# EAGLE design HydroPCB (EAGLE 9.3.2)
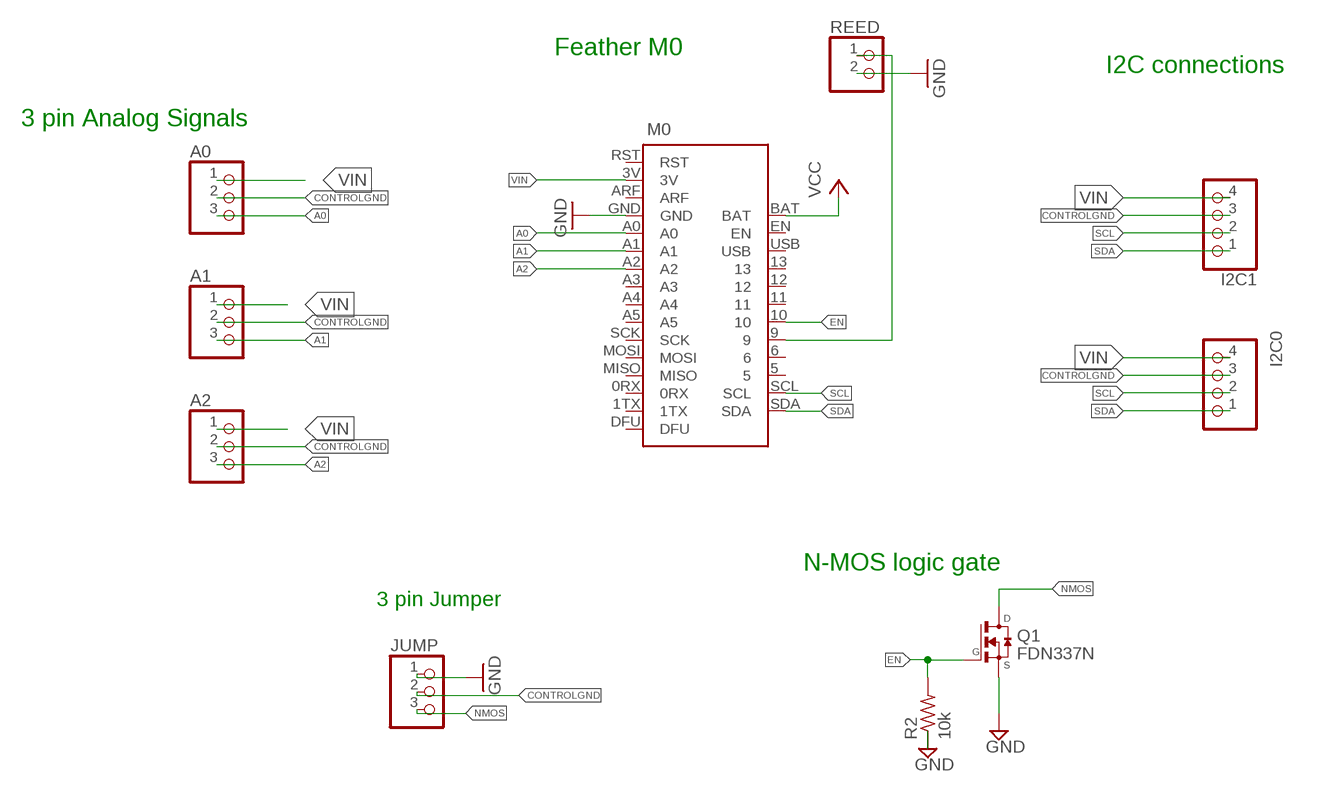
[diagram p0: schematic, sheet 1]

## Parts
A0  PINHD-1X3  [1X03]
A1  PINHD-1X3  [1X03]
A2  PINHD-1X3  [1X03]
I2C0  PINHD-1X4  [1X04]
I2C1  PINHD-1X4  [1X04]
JUMP  PINHD-1X3  [1X03]
M0  BLUEFRUIT_M0  [BLUEFRUIT_MO]
Q1  FDN337N  [SSOT-3]
R2  10k  R-US_R1206  [R1206]
REED  PINHD-1X2  [1X02]

## Nets
A0: A0.3 M0.A0
A1: A1.3 M0.A1
A2: A2.3 M0.A2
CONTROLGND: A0.2 A1.2 A2.2 I2C0.3 I2C1.3 JUMP.2
EN: M0.10 Q1.1(G) R2.2
GND: JUMP.1 M0.GND Q1.2(S) R2.1 REED.2
N$2: M0.9 REED.1
NMOS: JUMP.3 Q1.3(D)
SCL: I2C0.2 I2C1.2 M0.SCL
SDA: I2C0.1 I2C1.1 M0.SDA
VCC: M0.BAT
VIN: A0.1 A1.1 A2.1 I2C0.4 I2C1.4 M0.3V
Unconnected: M0.0RX M0.1TX M0.5 M0.6 M0.11 M0.12 M0.13 M0.A3 M0.A4 M0.A5 M0.ARF M0.DFU M0.EN M0.MISO M0.MOSI M0.RST M0.SCK M0.USB

## Notes on the sheet
- Feather M0
- I2C connections
- 3 pin Analog Signals
- N-MOS logic gate
- 3 pin Jumper

## Library data of the parts
A0 A1 A2 JUMP = pinhead:PINHD-1X3: PIN HEADER
I2C0 I2C1 = pinhead:PINHD-1X4: PIN HEADER
M0 = bluefruit_m0:BLUEFRUIT_M0
Q1 = FDN337N:FDN337N: N-Channel MOSFET Logic Level Enhancement Mode Field Effect Transistor; AVAILABILITY: Unavailable; DESCRIPTION: N-Channel 30 V 65 mOhm Surface Mount Field Effect Transistor - SSOT-3; MF: ON Semiconductor; MP: FDN337N; PACKAGE: SC-59 ON Semiconductor; PRICE: None
R2 = rcl:R-US_: RESISTOR, American symbol; SPICEPREFIX: R
REED = pinhead:PINHD-1X2: PIN HEADER

## Module TURB
Ports: 

### Library data of the parts

## Net classes
0 default: width 0.254 mm, clearance 0.203 mm
1 power: width 0.356 mm, clearance 0.254 mm

## Board
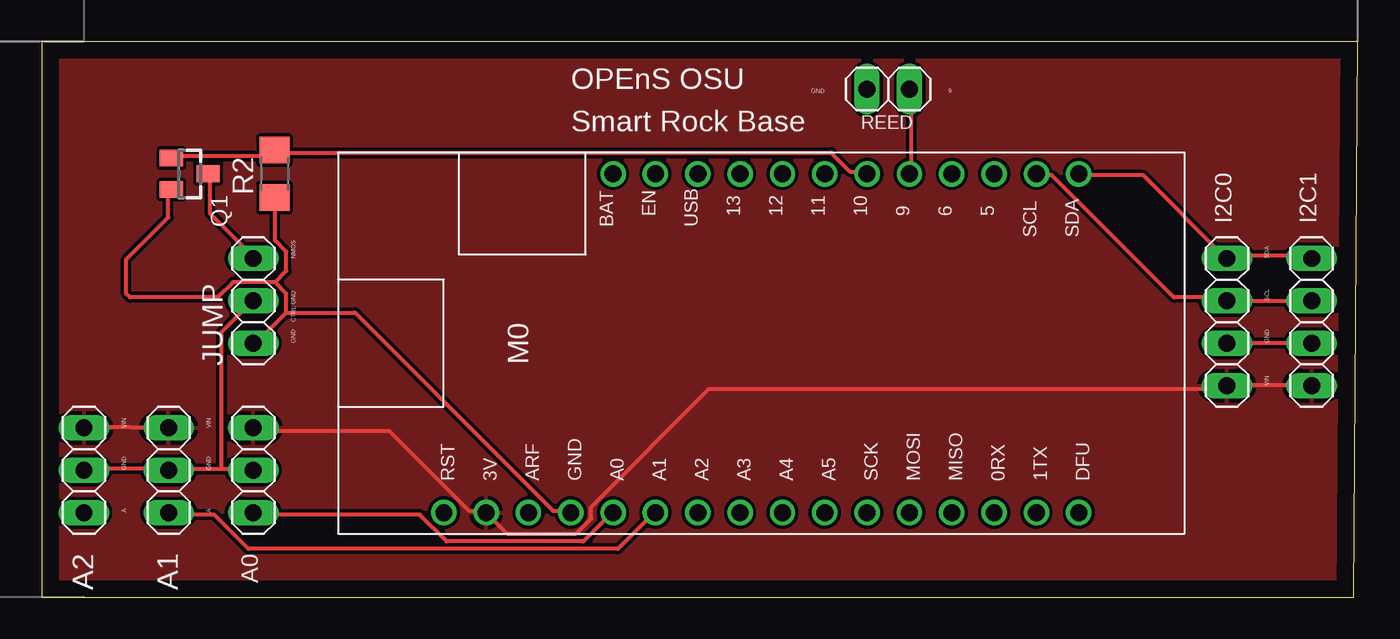
[diagram p1: board, top side]
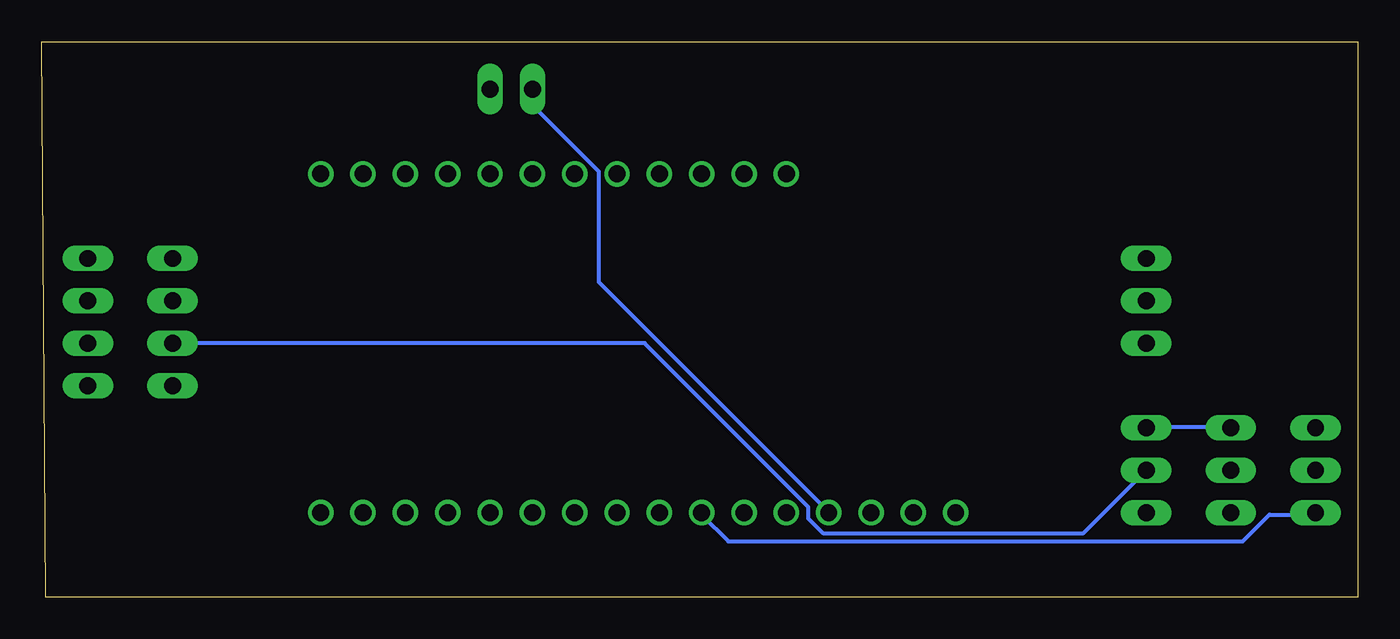
[diagram p2: board, bottom side, seen from below]

Size 78.97 x 33.33 mm. Coordinates in mm from the lower left corner, seen from the top.
Outline: 0,0 78.72,0 78.97,33.33 0,33.33 0,0
Copper layers (1*16): Top 0.035mm / dielectric 1.5mm / Bottom 0.035mm
Design rules "default": minimum track width 6mil, minimum drill 0.35mm, track to track 6mil, track to pad 6mil, pad to pad 6mil, via to via 6mil, smd to smd 6mil, copper to edge 40mil, drill to drill 6mil, minimum pad ring 10mil, minimum via ring 8mil, stop-mask expansion 4mil, vias tented up to drill 0mil, thermal gap 10mil

### Footprints (pad centres in the part's own frame; a part is rotated, then mirrored left to right if it is on the bottom)
1X03 = drill 1.016 long: 1 -2.54,0; 2 0,0; 3 2.54,0
1X04 = drill 1.016 long: 1 -3.81,0; 2 -1.27,0; 3 1.27,0; 4 3.81,0
BLUEFRUIT_MO = drill 1.016: 0RX 39.37,1.27; 1TX 41.91,1.27; 3V 8.89,1.27; 5 39.37,21.59; 6 36.83,21.59; 9 34.29,21.59; 10 31.75,21.59; 11 29.21,21.59; 12 26.67,21.59; 13 24.13,21.59; A0 16.51,1.27; A1 19.05,1.27; A2 21.59,1.27; A3 24.13,1.27; A4 26.67,1.27; A5 29.21,1.27; ARF 11.43,1.27; BAT 16.51,21.59; DFU 44.45,1.27; EN 19.05,21.59; GND 13.97,1.27; MISO 36.83,1.27; MOSI 34.29,1.27; RST 6.35,1.27; SCK 31.75,1.27; SCL 41.91,21.59; SDA 44.45,21.59; USB 21.59,21.59
SSOT-3 = smd 1 x 1.4: 1 -0.95,-1.1; 2 0.95,-1.1; 3 0,1.1
R1206 = smd 1.6 x 1.803: 1 -1.422,0; 2 1.422,0
1X02 = drill 1.016 long: 1 -1.27,0; 2 1.27,0

### Placement (x,y rotation side)
A0  12.7,7.62 270 top
A1  7.62,7.62 270 top
A2  2.54,7.62 270 top
I2C0  71.12,16.51 270 top
I2C1  76.2,16.51 270 top
JUMP  12.7,17.78 90 top
M0  17.78,3.81 0 top
Q1  8.89,25.4 270 top
R2  13.97,25.4 90 top
REED  50.8,30.48 180 top

### Tracks (layer width: path | path; a pad name or v marks a point on that pad's centre or on a via)
A0
  Top 0.254: A0.3 12.85,4.95 22.68,4.95 24.28,3.35 32.51,3.35 34.11,4.95 M0.A0
A1
  Top 0.254: A1.3 7.82,4.95 10.34,4.95 12.39,2.9 34.57,2.9 36.63,4.95 M0.A1
A2
  Bottom 0.254: A2.3 2.56,4.95 5.31,4.95 6.91,3.35 37.77,3.35 39.37,4.95 M0.A2
CONTROLGND
  Top 0.254: I2C1.3 I2C0.3 | A2.2 2.56,7.7 7.59,7.7 A1.2 7.82,7.7 10.79,7.7 | 10.79,7.7 12.62,7.7 A0.2 | 10.79,7.7 10.79,15.93 12.62,17.75 JUMP.2
  Bottom 0.254: I2C0.3 42.8,15.24 32.97,5.41 32.97,4.72 32.05,3.81 16.51,3.81 A0.2
EN
  Top 0.254: 13.97,26.75 R2.2 | Q1.1 7.82,26.44 13.54,26.44 13.77,26.67 R2.2 | M0.10 49.43,25.53 48.51,25.53 47.37,26.67 13.99,26.67 R2.2
GND
  Top 0.254: 13.64,24.28 R2.1 13.99,23.93 13.99,21.41 14.68,20.73 14.68,19.58 13.99,18.9 | 13.99,18.9 11.48,18.9 10.57,17.98 5.31,17.98 5.08,18.21 5.08,20.27 7.59,22.78 7.59,24.38 Q1.2 | 13.99,18.9 14.68,18.21 14.68,17.07 | 14.68,17.07 12.85,15.24 JUMP.1 | 14.68,17.07 18.8,17.07 30.68,5.18 31.6,5.18 M0.GND
  Bottom 0.254: REED.2 49.43,30.33 49.43,29.41 45.54,25.53 45.54,18.9 31.83,5.18 M0.GND
N$2
  Top 0.254: M0.9 52.17,25.53 52.17,30.33 REED.1
NMOS
  Top 0.254: 9.98,25.2 Q1.3 10.11,25.3 10.11,23.01 12.62,20.5 JUMP.3
SCL
  Top 0.254: I2C1.2 76.17,17.75 71.14,17.75 I2C0.2 70.92,17.98 67.94,17.98 60.63,25.3 59.71,25.3 M0.SCL
SDA
  Top 0.254: I2C1.1 76.17,20.5 71.14,20.5 I2C0.1 70.92,20.5 66.12,25.3 62.23,25.3 M0.SDA
VIN
  Top 0.254: I2C1.4 76.17,12.72 71.14,12.72 I2C0.4 70.92,12.5 40.06,12.5 32.97,5.41 32.97,4.72 32.05,3.81 27.94,3.81 M0.3V 26.57,5.18 25.65,5.18 20.85,9.98 12.85,9.98 A0.1 | A1.1 7.59,10.21 5.31,10.21 5.08,10.21 2.56,10.21 A2.1
  Bottom 0.254: A0.1 12.62,10.21 7.82,10.21 A1.1
  pour Top: 0,33.02 0,0 77.47,0 78.74,1.27 78.74,33.02

### Text on the board
tNames: OPEnS OSU | GND | 9 | Smart Rock Base | NMOS | SDA | SCL | CTRL GND | GND | GND | VIN | VIN | VIN | GND | GND | A | A